# EAGLE schematic fio_8x8 (EAGLE 4.92)
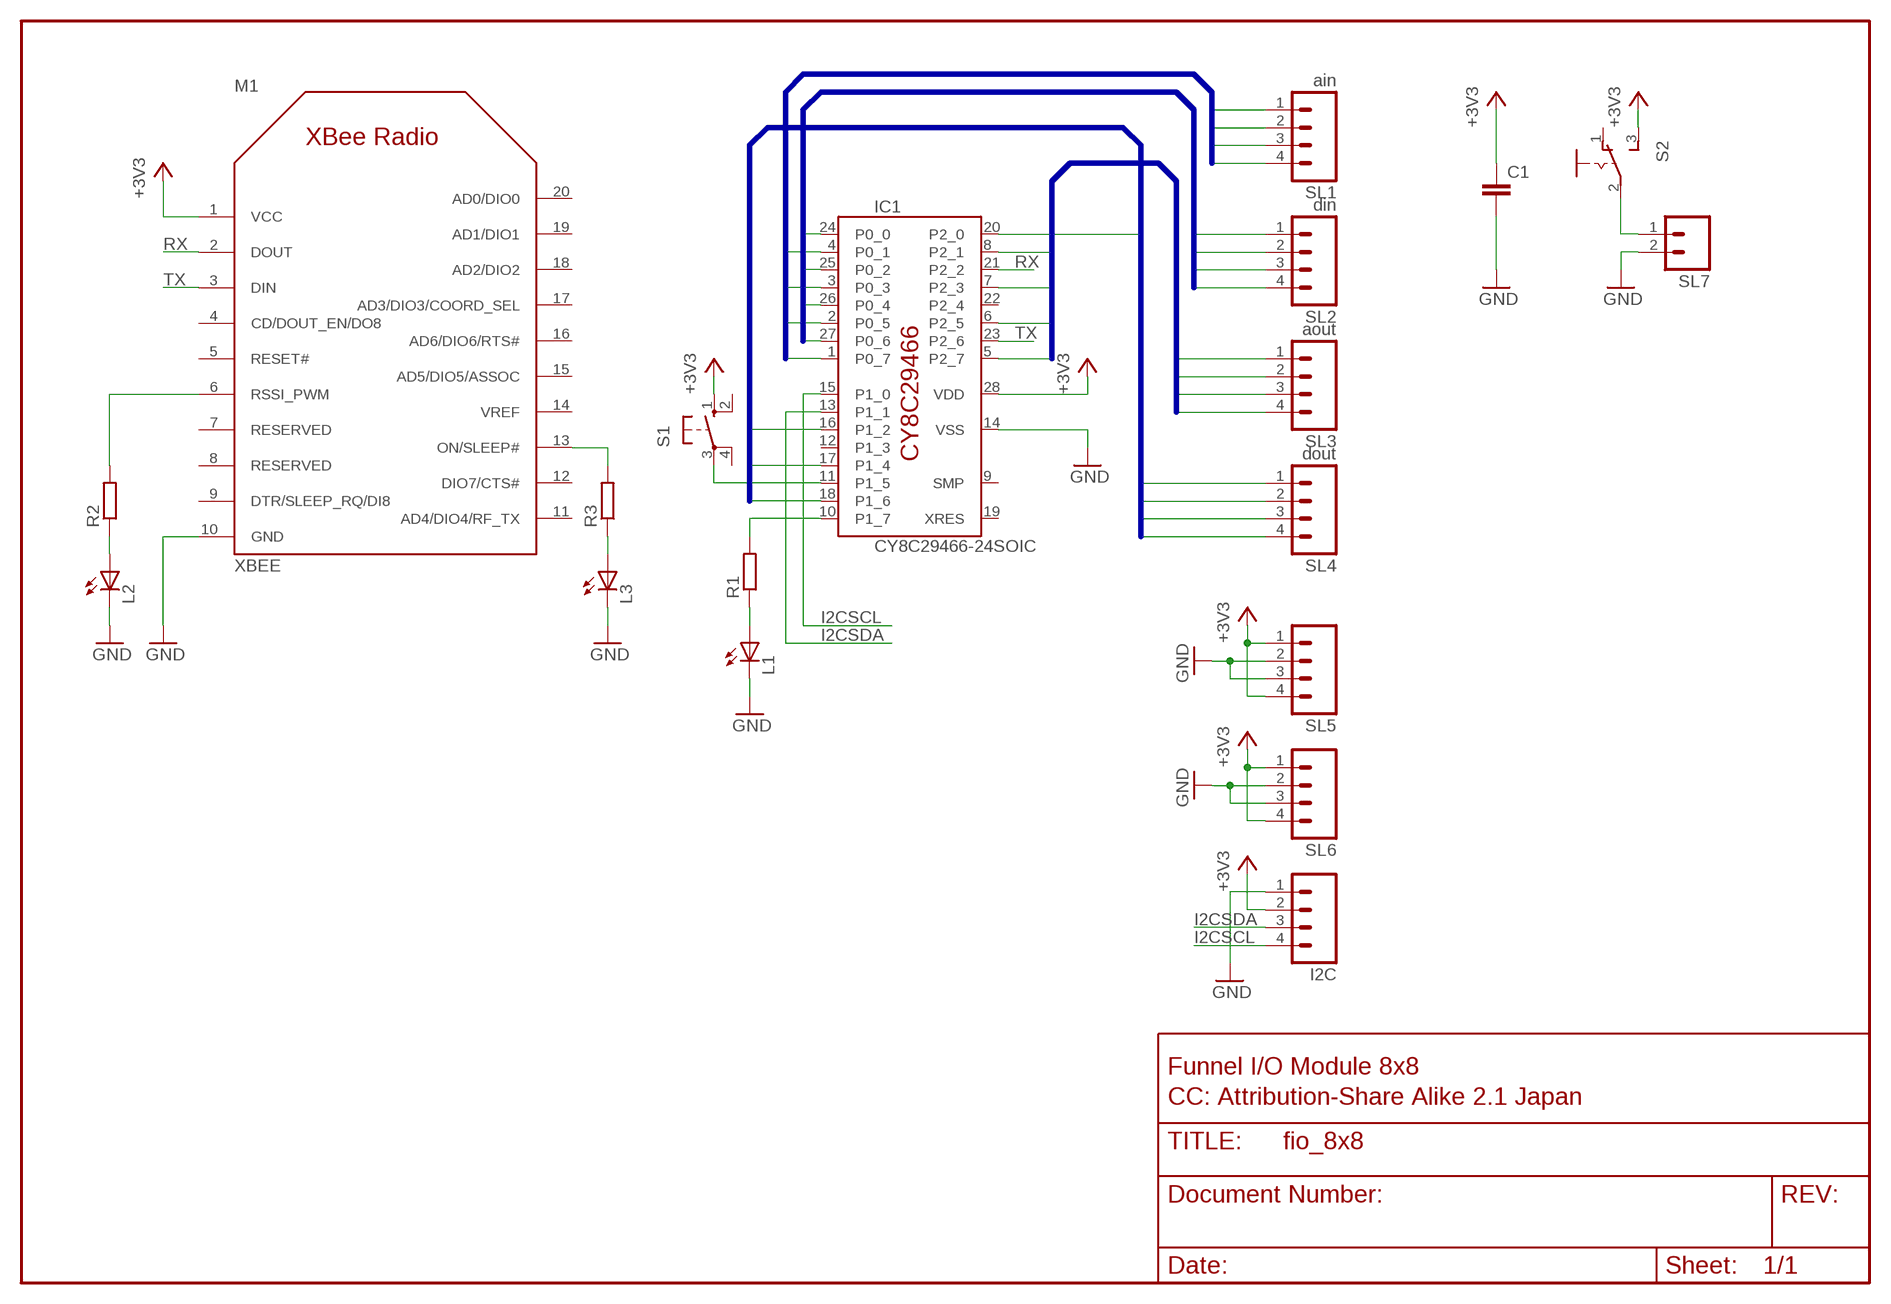
[diagram p0: schematic, sheet 1]

## Parts
C1  C-EUC0603K  [C0603K]
I2C  M04PTH  [1X04]
IC1  CY8C29466-24SOIC  [SOIC28]
L1  LEDCHIPLED_0805  [CHIPLED_0805]
L2  LEDCHIPLED_0805  [CHIPLED_0805]
L3  LEDCHIPLED_0805  [CHIPLED_0805]
M1  XBEE  [XBEE]
R1  R-EU_R0603  [R0603]
R2  R-EU_R0603  [R0603]
R3  R-EU_R0603  [R0603]
S1  10-XX  [B3F-10XX]
S2  S-SWITCH-3  [DS-3]
SL1  ain  M04PTH  [1X04]
SL2  din  M04PTH  [1X04]
SL3  aout  M04PTH  [1X04]
SL4  dout  M04PTH  [1X04]
SL5  M04PTH  [1X04]
SL6  M04PTH  [1X04]
SL7  M02POLAR  [MOLEX-1X2]

## Nets
+3V3: C1.1 I2C.2 IC1.28(VDD) M1.1(VCC) S1.1(S) S2.3(S) SL5.1 SL5.4 SL6.1 SL6.4
AIN1: IC1.1(P0_7) SL1.1
AIN2: IC1.2(P0_5) SL1.2
AIN3: IC1.3(P0_3) SL1.3
AIN4: IC1.4(P0_1) SL1.4
AOUT1: IC1.5(P2_7) SL3.1
AOUT2: IC1.6(P2_5) SL3.2
AOUT3: IC1.7(P2_3) SL3.3
AOUT4: IC1.8(P2_1) SL3.4
DIN1: IC1.27(P0_6) SL2.1
DIN2: IC1.26(P0_4) SL2.2
DIN3: IC1.25(P0_2) SL2.3
DIN4: IC1.24(P0_0) SL2.4
DOUT1: IC1.20(P2_0) SL4.1
DOUT2: IC1.18(P1_6) SL4.2
DOUT3: IC1.17(P1_4) SL4.3
DOUT4: IC1.16(P1_2) SL4.4
GND: C1.2 I2C.1 IC1.14(VSS) L1.C L2.C L3.C M1.10(GND) SL5.2 SL5.3 SL6.2 SL6.3 SL7.2
I2CSCL: I2C.4 IC1.15(P1_0)
I2CSDA: I2C.3 IC1.13(P1_1)
N$1: S2.2(P) SL7.1
N$3: L2.A R2.1
N$4: M1.6(RSSI_PWM) R2.2
N$5: M1.13(ON/SLEEP#) R3.2
N$6: L3.A R3.1
N$8: IC1.11(P1_5) S1.3(P)
N$9: IC1.10(P1_7) R1.2
N$10: L1.A R1.1
RX: IC1.21(P2_2) M1.2(DOUT)
TX: IC1.23(P2_6) M1.3(DIN)
Unconnected: IC1.9(SMP) IC1.12(P1_3) IC1.19(XRES) IC1.22(P2_4) M1.4(CD/DOUT_EN/DO8) M1.5(RESET#) M1.7(RESERVED) M1.8(RESERVED) M1.9(DTR/SLEEP_RQ/DI8) M1.11(AD4/DIO4/RF_TX) M1.12(DIO7/CTS#) M1.14(VREF) M1.15(AD5/DIO5/ASSOC) M1.16(AD6/DIO6/RTS#) M1.17(AD3/DIO3/COORD_SEL) M1.18(AD2/DIO2) M1.19(AD1/DIO1) M1.20(AD0/DIO0) S1.2(S1) S1.4(P1) S2.1(O)

## Buses
AIN[1..4]
DIN[1..4]
AOUT[1..4]
DOUT[1..4]

## Notes on the sheet
- Funnel I/O Module 8x8
- CC: Attribution-Share Alike 2.1 Japan

## Library data of the parts
C1 = rcl:C-EU: CAPACITOR, European symbol
I2C SL1-SL6 = SparkFun-3-2-07:M04: Header 4 Standard 4-pin 0.1" header. Use with straight break away headers (SKU : PType-HD), right angle break away headers (PType-HD-RightAngle), swiss pins (PType-30F), machine pins (PType-MP), and female headers (PType-FH). Molex polarized connector foot print use with SKU : Con-Hdr with associated crimp pins and housings.
IC1 = cypress-psoc:CY8C29466-24*
L1-L3 = led:LED: LED OSRAM: - CHIPLED LG R971, LG N971, LY N971, LG Q971, LY Q971, LO R971, LY R971 LH N974, LH R974 LS Q976, LO Q976, LY Q976 LO Q996 - Hyper CHIPLED LW Q18S LB Q993, LB Q99A, LB R99A - SideLED LS A670, LO A670, LY A670, LG A670, LP A670 LB A673, LV A673, LT A673, LW A673 LH A674 LY A675 LS A676, LA A676, LO A676, LY A676, LW A676 LS A679, LY A679, LG A679 - Hyper Micro SIDELED® LS Y876, LA Y876, LO Y876, LY Y876 LT Y87S - SmartLED LW L88C, LW L88S LB L89C, LB L89S, LG L890 LS L89K, LO L89K, LY L89K LS L896, LA L896, LO L896, LY L896 - TOPLED LS T670, LO T670, LY T670, LG T670, LP T670 LSG T670, LSP T670, LSY T670, LOP T670, LYG T670 LG T671, LOG T671, LSG T671 LB T673, LV T673, LT T673, LW T673 LH T674 LS T676, LA T676, LO T676, LY T676, LB T676, LH T676, LSB T676, LW T676 LB T67C, LV T67C, LT T67C, LS T67K, LO T67K, LY T67K, LW E67C LS E67B, LA E67B, LO E67B, LY E67B, LB E67C, LV E67C, LT E67C LW T67C LS T679, LY T679, LG T679 LS T770, LO T770, LY T770, LG T770, LP T770 LB T773, LV T773, LT T773, LW T773 LH T774 LS E675, LA E675, LY E675, LS T675 LS T776, LA T776, LO T776, LY T776, LB T776 LHGB T686 LT T68C, LB T68C - Hyper Mini TOPLED® LB M676 - Mini TOPLED Santana® LG M470 LS M47K, LO M47K, LY M47K Source: http://www.osram.convergy.de - LUMILED® LXK2-PW12-R00, LXK2-PW12-S00, LXK2-PW14-U00, LXK2-PW14-V00 LXK2-PM12-R00, LXK2-PM12-S00, LXK2-PM14-U00 LXK2-PE12-Q00, LXK2-PE12-R00, LXK2-PE12-S00, LXK2-PE14-T00, LXK2-PE14-U00 LXK2-PB12-K00, LXK2-PB12-L00, LXK2-PB12-M00, LXK2-PB14-N00, LXK2-PB14-P00, LXK2-PB14-Q00 LXK2-PR12-L00, LXK2-PR12-M00, LXK2-PR14-Q00, LXK2-PR14-R00 LXK2-PD12-Q00, LXK2-PD12-R00, LXK2-PD12-S00 LXK2-PH12-R00, LXK2-PH12-S00 LXK2-PL12-P00, LXK2-PL12-Q00, LXK2-PL12-R00 Source: www.luxeon.com
M1 = xbee_r1:XBEE
R1-R3 = rcl:R-EU_: RESISTOR, European symbol
S1 = switch-omron:10-XX: OMRON SWITCH
S2 = 1-sw:S-SWITCH: SLIDE SWITCH
SL7 = SparkFun-3-2-07:M02: Header 2 Standard 2-pin 0.1" header. Use with straight break away headers (SKU : PType-HD), right angle break away headers (PType-HD-RightAngle), swiss pins (PType-30F), machine pins (PType-MP), and female headers (PType-FH). Molex polarized connector foot print use with SKU : Con-Hdr with associated crimp pins and housings.

## Net classes
1 +5v: width 0.813 mm
2 GND: width 0.813 mm